# Altium schematic sheet PCB_Schema.SchDoc
size A
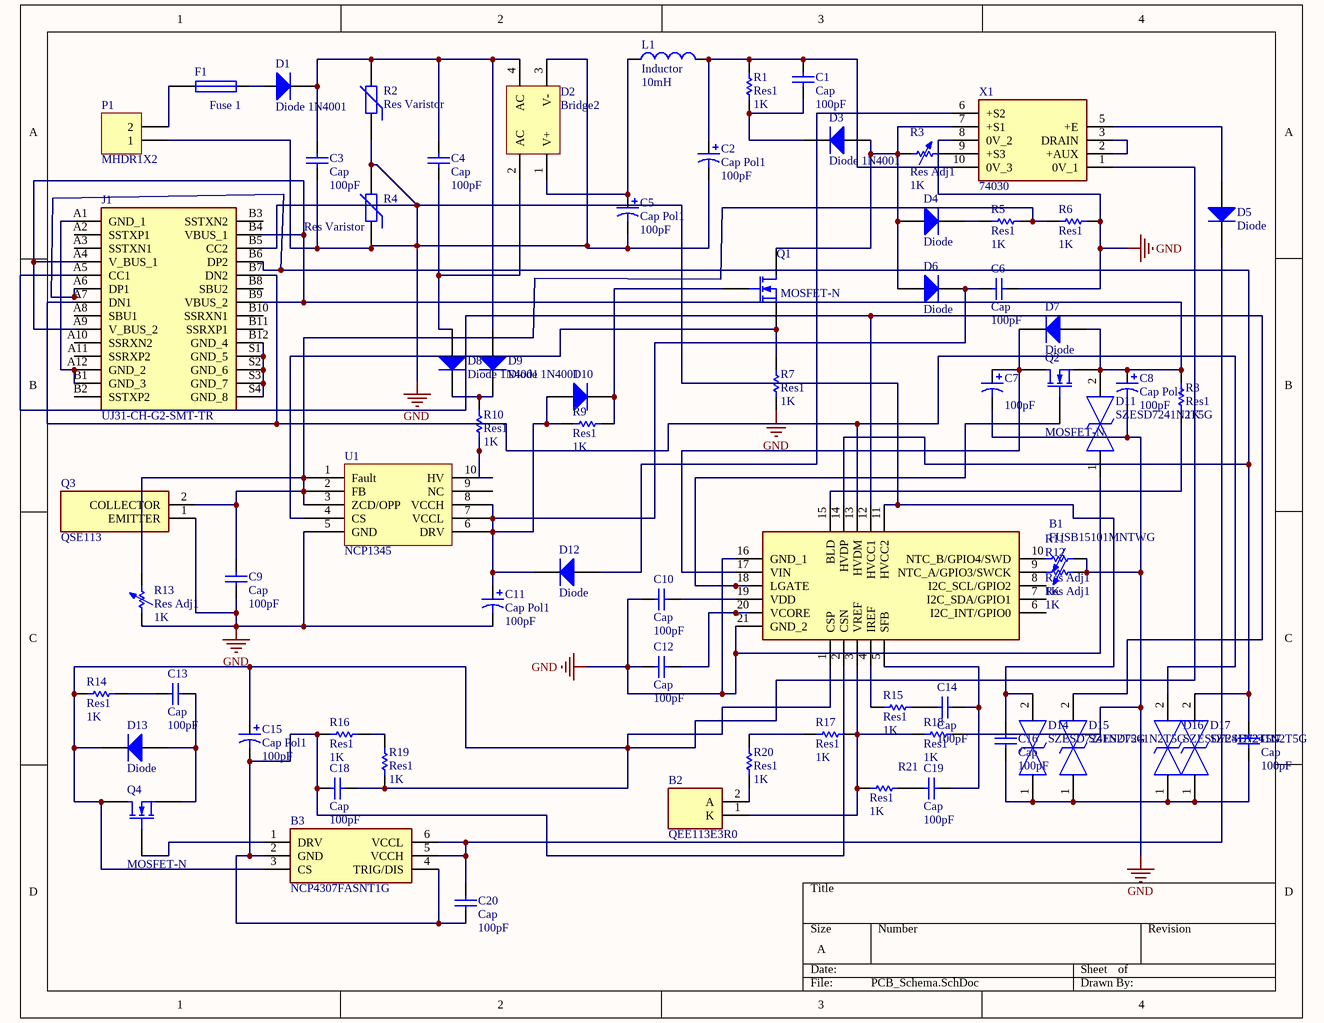
[diagram p0: PCB_Schema.SchDoc]

## Parts
B1  FUSB15101MNTWG  [QFN50P400X400X100-21N]  (mechanical)
B2  QEE113E3R0  [QEE113E3R0]
B3  NCP4307FASNT1G  [SOT95P275X110-6N]
C1  Cap  value 100pF  [RAD-0.3]
C2  Cap Pol1  value 100pF  [RB7.6-15]
C3  Cap  value 100pF  [RAD-0.3]
C4  Cap  value 100pF  [RAD-0.3]
C5  Cap Pol1  value 100pF  [RB7.6-15]
C6  Cap  value 100pF  [RAD-0.3]
C7  value 100pF  [RB7.6-15]
C8  Cap Pol1  value 100pF  [RB7.6-15]
C9  Cap  value 100pF  [RAD-0.3]
C10  Cap  value 100pF  [RAD-0.3]
C11  Cap Pol1  value 100pF  [RB7.6-15]
C12  Cap  value 100pF  [RAD-0.3]
C13  Cap  value 100pF  [RAD-0.3]
C14  Cap  value 100pF  [RAD-0.3]
C15  Cap Pol1  value 100pF  [RB7.6-15]
C16  Cap  value 100pF  [RAD-0.3]
C17  Cap  value 100pF  [RAD-0.3]
C18  Cap  value 100pF  [RAD-0.3]
C19  Cap  value 100pF  [RAD-0.3]
C20  Cap  value 100pF  [RAD-0.3]
D1  Diode 1N4001  [DO-41]
D2  Bridge2  [D-46_6A]
D3  Diode 1N4001  [DO-41]
D4  Diode  [SMC]
D5  Diode  [SMC]
D6  Diode  [SMC]
D7  Diode  [SMC]
D8  Diode 1N4001  [DO-41]
D9  Diode 1N4001  [DO-41]
D10  (no value)  [SMC]
D11  SZESD7241N2T5G  [SZESD7462N2T5G]
D12  Diode  [SMC]
D13  Diode  [SMC]
D14  SZESD7241N2T5G  [SZESD7462N2T5G]
D15  SZESD7241N2T5G  [SZESD7462N2T5G]
D16  SZESD7241N2T5G  [SZESD7462N2T5G]
D17  SZESD7241N2T5G  [SZESD7462N2T5G]
F1  Fuse 1  [PIN-W2/E2.8]
J1  UJ31-CH-G2-SMT-TR  [UJ31CHG2SMTTR]
L1  Inductor  value 10mH  [0402-A]
P1  MHDR1X2  [MHDR1X2]
Q1  MOSFET-N  [E3]
Q2  MOSFET-N  [E3]
Q3  QSE113  [TO254P304X444X533-2P]
Q4  MOSFET-N  [E3]
R1  Res1  value 1K  [AXIAL-0.3]
R2  Res Varistor  [6-0805_N]
R3  Res Adj1  value 1K  [AXIAL-0.7]
R4  Res Varistor  [6-0805_N]
R5  Res1  value 1K  [AXIAL-0.3]
R6  Res1  value 1K  [AXIAL-0.3]
R7  Res1  value 1K  [AXIAL-0.3]
R8  Res1  value 1K  [AXIAL-0.3]
R9  Res1  value 1K  [AXIAL-0.3]
R10  Res1  value 1K  [AXIAL-0.3]
R11  Res Adj1  value 1K  [AXIAL-0.7]
R12  Res Adj1  value 1K  [AXIAL-0.7]
R13  Res Adj1  value 1K  [AXIAL-0.7]
R14  Res1  value 1K  [AXIAL-0.3]
R15  Res1  value 1K  [AXIAL-0.3]
R16  Res1  value 1K  [AXIAL-0.3]
R17  Res1  value 1K  [AXIAL-0.3]
R18  Res1  value 1K  [AXIAL-0.3]
R19  Res1  value 1K  [AXIAL-0.3]
R20  Res1  value 1K  [AXIAL-0.3]
R21  Res1  value 1K  [AXIAL-0.3]
U1  NCP1345  [SOP100P600X265-10N]
X1  74030  [74030]

## Nets
GND: B1.11(HVCC2) B1.16(GND_1) B1.21(GND_2) C2.2 C3.1 C5.2 C6.1 C7.2 C8.2 C9.1 C10.1 C11.2 C12.1 C16.2 D2.3(V-) D11.1 D14.2 J1.B5(CC2) P1.1 Q3.1(EMITTER) R2.1 R4.1 R4.2 R6.1 R7.1 R11.1 R12.1 R13.1 R18.1 U1.5(GND) X1.8(0V_2)
NetB1_1: B1.1(CSP) B3.3(CS) C15.1 C18.2 D13.2(K) Q4.1(D) R14.1 R19.1 X1.1(0V_1)
NetB1_2: B1.2(CSN) B3.2(GND) B3.4(TRIG/DIS) C15.2 C18.1 C20.2 R16.1
NetB1_3: B1.3(VREF) B2.1(K) R17.1 R18.2 R21.1
NetB1_4: B1.4(IREF) R15.1
NetB1_5: B1.5(SFB) C14.2 C19.2
NetB1_12: B1.12(HVCC1) D15.2 J1.A5(CC1)
NetB1_13: B1.13(HVDM) D16.2 J1.A7(DN1) J1.B7(DN2)
NetB1_14: B1.14(HVDP) C17.2 D17.2 J1.A6(DP1) J1.B6(DP2)
NetB1_15: B1.15(BLD) R8.1
NetB1_17: B1.17(VIN) C7.1 D7.2(K) Q2.1(D)
NetB1_18: B1.18(LGATE) Q2.2(G)
NetB1_19: B1.19(VDD) C10.2
NetB1_20: B1.20(VCORE) C12.2
NetB2_2: B2.2(A) R20.1
NetB3_1: B3.1(DRV) Q4.2(G)
NetB3_5: B3.5(VCCH) B3.6(VCCL) C20.1 D5.2(K)
NetC1_1: C1.1 D3.2(K) R1.1
NetC1_2: C1.2 C2.1 L1.2 R1.2 X1.10(0V_3)
NetC3_2: C3.2 C4.2 D1.2(K) D2.4(AC) D9.1(A) R2.2
NetC4_1: C4.1 D2.2(AC) D8.1(A)
NetC5_1: C5.1 D2.1(V+) L1.1
NetC6_2: C6.2 C11.1 D6.2(K) D10.1(A) D12.2(K) R9.1 U1.6(DRV) U1.7(VCCL) U1.8(VCCH)
NetC8_1: C8.1 D7.1(A) D11.2 J1.A4(V_BUS_1) J1.A9(V_BUS_2) J1.B4(VBUS_1) J1.B9(VBUS_2) Q2.3(S) R8.2
NetC9_2: C9.2 Q3.2(COLLECTOR) R5.1 R6.2 R13.2 U1.1(Fault) U1.2(FB) U1.3(ZCD/OPP)
NetC13_1: C13.1 R14.2
NetC13_2: C13.2 D13.1(A) Q4.3(S)
NetC14_1: C14.1 R15.2
NetC16_1: C16.1 C17.1 D14.1 D15.1 D16.1 D17.1
NetC19_1: C19.1 R21.2
NetD1_1: D1.1(A) F1.2
NetD3_1: D3.1(A) D4.1(A) D6.1(A) Q1.1(D) R3.1 X1.7(+S1)
NetD4_2: D4.2(K) R5.2
NetD5_1: D5.1(A) X1.5(+E)
NetD8_2: D8.2(K) D9.2(K) R10.2
NetD10_2: D10.2(K) Q1.2(G) R9.2
NetD12_1: D12.1(A) X1.6(+S2)
NetF1_1: F1.1 P1.2
NetJ1_A1: J1.A1(GND_1) J1.A12(GND_2) J1.B1(GND_3)
NetJ1_B12: J1.B12(GND_4) J1.S1(GND_5) J1.S2(GND_6) J1.S3(GND_7) J1.S4(GND_8)
NetQ1_3: Q1.3(S) R7.2 U1.4(CS)
NetR3_2: R3.2 X1.9(+S3)
NetR10_1: R10.1 U1.10(HV)
NetR16_2: R16.2 R19.2
NetR17_2: R17.2 R20.2
NetX1_2: X1.2(+AUX) X1.3(DRAIN)

Not connected (* = marked no-connect by the designer): B1 6(I2C_INT/GPIO0) 7(I2C_SDA/GPIO1) 8(I2C_SCL/GPIO2) 9(NTC_A/GPIO3/SWCK) 10(NTC_B/GPIO4/SWD); J1 A2(SSTXP1) A3(SSTXN1) A8(SBU1) A10(SSRXN2) A11(SSRXP2) B2(SSTXP2) B3(SSTXN2) B8(SBU2) B10(SSRXN1) B11(SSRXP1); R11 2; R12 2; U1 9(NC)

## Library data of the parts
B1 = FUSB15101MNTWG: Programmable USB Type-C and Power Delivery 3.1 Source Controller with PPS Support; Manufacturer_Name: onsemi; Geometry.Height: 1mm; Manufacturer_Part_Number: FUSB15101MNTWG; Mouser Part Number: 863-FUSB15101MNTWG; Mouser Price/Stock: https://www.mouser.co.uk/ProductDetail/onsemi/FUSB15101MNTWG?qs=vvQtp7zwQdPKtIXEUZSS0g%3D%3D; Arrow Part Number: *; Arrow Price/Stock: *; Mouser Testing Part Number: *; Mouser Testing Price/Stock: *; Datasheet Link: https://www.onsemi.com/download/data-sheet/pdf/fusb15101-d.pdf
B2 = QEE113E3R0: Infrared Emitters infrared Lt Emitting Plastic; Manufacturer_Name: onsemi; Geometry.Height: 5.08mm; Manufacturer_Part_Number: QEE113E3R0; Mouser Part Number: 512-QEE113E3R0; Mouser Price/Stock: https://www.mouser.co.uk/ProductDetail/ON-Semiconductor-Fairchild/QEE113E3R0?qs=q8yi3gPquyFixpeP%252BjxTrw%3D%3D; Arrow Part Number: QEE113E3R0; Arrow Price/Stock: https://www.arrow.com/en/products/qee113e3r0/on-semiconductor?region=nac; Datasheet Link: https://www.arrow.com/en/products/qee113e3r0/on-semiconductor
B3 = NCP4307FASNT1G: Secondary Side Synchronous Rectification Driver with Dual Supply; Manufacturer_Name: onsemi; Geometry.Height: 1.1mm; Manufacturer_Part_Number: NCP4307FASNT1G; Mouser Part Number: *; Mouser Price/Stock: *; Arrow Part Number: *; Arrow Price/Stock: *; Datasheet Link: https://www.onsemi.com/download/data-sheet/pdf/ncp4307-d.pdf
C1 C3 C4 C6 C9 C10 C12-C14 C16-C20 = Cap: Capacitor; Published: 8-Jun-2000; LatestRevisionDate: 17-Jul-2002; LatestRevisionNote: Re-released for DXP Platform.; PackageReference: RAD-0.3; Publisher: Altium Limited; PackageDescription: Radial Cap, Thru-Hole; 2 Leads; 0.3 in Pin Spacing
C2 C5 C7 C8 C11 C15 = Cap Pol1: Polarized Capacitor (Radial); Published: 8-Jun-2000; LatestRevisionDate: 17-Jul-2002; LatestRevisionNote: Re-released for DXP Platform.; PackageReference: RB7.6-15; Publisher: Altium Limited; PackageDescription: Polarized Capacitor (Radial); 2 Leads
D1 D3 D8 D9 = Diode 1N4001: 1 Amp General Purpose Rectifier; Published: 8-Jun-2000; LatestRevisionDate: 17-Jul-2002; LatestRevisionNote: Re-released for DXP Platform.; DatasheetVersion: 1998; PackageVersion: Aug-1999; PackageReference: DO-41; Publisher: Altium Limited; PackageDescription: Diode, Axial; Body 5.2 x 2.7 mm (LxDia. max), Lead Dia. 0.86 mm (max); Code_JEDEC: DO-204-AL; ComponentLink1Description: Manufacturer Link; ComponentLink1URL: http://www.fairchildsemi.com/; ComponentLink2Description: Datasheet; ComponentLink2URL: http://www.fairchildsemi.com/ds/1N%2F1N4001.pdf
D2 = Bridge2: Diode Bridge; Published: 24-Mar-1999; LatestRevisionDate: 17-Jul-2002; LatestRevisionNote: Re-released for DXP Platform.; PackageReference: D-46_6A; Publisher: Altium Limited; PackageDescription: Bridge Rectifier; 4 Terminals; Body 16.8 x 16.8 mm (typ); Pitch 10.67 mm
D4-D7 D10 D12 D13 = Diode: Default Diode; Published: 8-Jun-2000; LatestRevisionDate: 17-Jul-2002; LatestRevisionNote: Re-released for DXP Platform.; PackageVersion: Sep-1996; PackageReference: SMC; Publisher: Altium Limited; PackageDescription: DO-214-AB/SMC; 2 C-Bend Leads; Body 7.9 x 5.9 mm, inc. leads (LxW); Code_JEDEC: DO-214-AB
D11 D14-D17 = SZESD7241N2T5G: ESD Suppressors / TVS Diodes SZ 24V VRWM ESD PROTECTION; Manufacturer_Name: onsemi; Geometry.Height: 0.4mm; Manufacturer_Part_Number: SZESD7241N2T5G; Mouser Part Number: 863-SZESD7241N2T5G; Mouser Price/Stock: https://www.mouser.co.uk/ProductDetail/onsemi/SZESD7241N2T5G?qs=z6PAvqrnkvSq0oMCl81g4Q%3D%3D; Arrow Part Number: *; Arrow Price/Stock: *; Datasheet Link: https://www.onsemi.com/pub/Collateral/ESD7241-D.PDF
F1 = Fuse 1: Fuse; Published: 8-Jun-2000; LatestRevisionDate: 17-Jul-2002; LatestRevisionNote: Re-released for DXP Platform.; PackageReference: PIN-W2/E2.8; Publisher: Altium Limited; PackageDescription: Thru-Hole; 2 Leads
J1 = UJ31-CH-G2-SMT-TR: USB Connectors USB jack 3.1 C type 24pin Horz SMT; Manufacturer_Name: CUI Devices; Geometry.Height: 4.66mm; Manufacturer_Part_Number: UJ31-CH-G2-SMT-TR; Mouser Part Number: 490-UJ31-CH-G2SMT-TR; Mouser Price/Stock: https://www.mouser.co.uk/ProductDetail/CUI-Devices/UJ31-CH-G2-SMT-TR?qs=W0yvOO0ixfGEsh2EYrPgIQ%3D%3D; Arrow Part Number: UJ31-CH-G2-SMT-TR; Arrow Price/Stock: https://www.arrow.com/en/products/uj31-ch-g2-smt-tr/cui-devices?region=nac; Datasheet Link: https://www.arrow.com/en/products/uj31-ch-g2-smt-tr/cui-devices
L1 = Inductor: Code_IEC: 1005; Published: 8-Jun-2000; LatestRevisionDate: 29-May-2009; LatestRevisionNote: IPC-7351 Footprint Added.; PackageReference: 0402-A; Publisher: Altium Limited; PackageDescription: Chip Inductor; Code_JEITA: 0402
P1 = MHDR1X2: Header, 2-Pin; LatestRevisionDate: 17-Jul-2002; LatestRevisionNote: Re-released for DXP Platform.; Publisher: Altium Limited
Q1 Q2 Q4 = MOSFET-N: N-Channel MOSFET; Published: 8-Jun-2000; LatestRevisionDate: 17-Jul-2002; LatestRevisionNote: Re-released for DXP Platform.; PackageVersion: 1995/1996; PackageReference: E3; Publisher: Altium Limited; PackageDescription: TO, Flat Index; 3 In-Line, Axial Leads; Body Dia. 4.6mm; Lead Dia. 0.5 mm (max)
Q3 = QSE113: IC, Fairchild, QSE113 Fairchild Semiconductor QSE113 25 ?? Infrared Phototransistor, Through-hole Side-looker Package; Manufacturer_Name: onsemi; Geometry.Height: 3.04mm; Manufacturer_Part_Number: QSE113; Mouser Part Number: 512-QSE113; Mouser Price/Stock: https://www.mouser.com/Search/Refine.aspx?Keyword=512-QSE113; Arrow Part Number: QSE113; Arrow Price/Stock: https://www.arrow.com/en/products/qse113/on-semiconductor; Datasheet Link: *
R1 R5-R10 R14-R21 = Res1: Resistor; Published: 8-Jun-2000; LatestRevisionDate: 17-Jul-2002; LatestRevisionNote: Re-released for DXP Platform.; PackageReference: AXIAL-0.3; Publisher: Altium Limited; PackageDescription: Axial Device, Thru-Hole; 2 Leads; 0.3 in Pin Spacing
R2 R4 = Res Varistor: Varistor (Voltage-Sensitive Resistor); Published: 24-Mar-1999; LatestRevisionDate: 29-May-2009; LatestRevisionNote: IPC-7351 Footprint Added.; PackageVersion: Mar-2003; PackageReference: 6-0805; Publisher: Altium Limited; PackageDescription: Chip Resistor 0805 Case Size; Code_IPC: RESC2012
R3 R11-R13 = Res Adj1: Variable Resistor; Set Position: 0.5; Published: 8-Jun-2000; LatestRevisionDate: 17-Jul-2002; LatestRevisionNote: Re-released for DXP Platform.; PackageReference: AXIAL-0.7; Publisher: Altium Limited; PackageDescription: Axial Device, Thru-Hole; 2 Leads; 0.7 in Pin Spacing
X1 = 74030: Transformer PCB Flyback EE25 750uH 3 Output 15  30W Flyback Switch Mode Power Supply Transformer, 85  265V ac; Manufacturer_Name: MYRRA; Manufacturer_Part_Number: 74030; Mouser Part Number: *; Mouser Price/Stock: *; Arrow Part Number: 74030; Arrow Price/Stock: https://www.arrow.com/en/products/74030/myrra; Datasheet Link: *